# EasyEDA Pro project qn8027_FM调制.eprj

# Schematic Schematic1
Board Name: Board1; Create Date: 2025-07-04; Page Name: P1; Project Name: qn8027_FM调制; Schematic Name: Schematic1; Update Date: 2025-07-05; Company: 嘉立创EDA; Page Size: A4; Version: V1.0
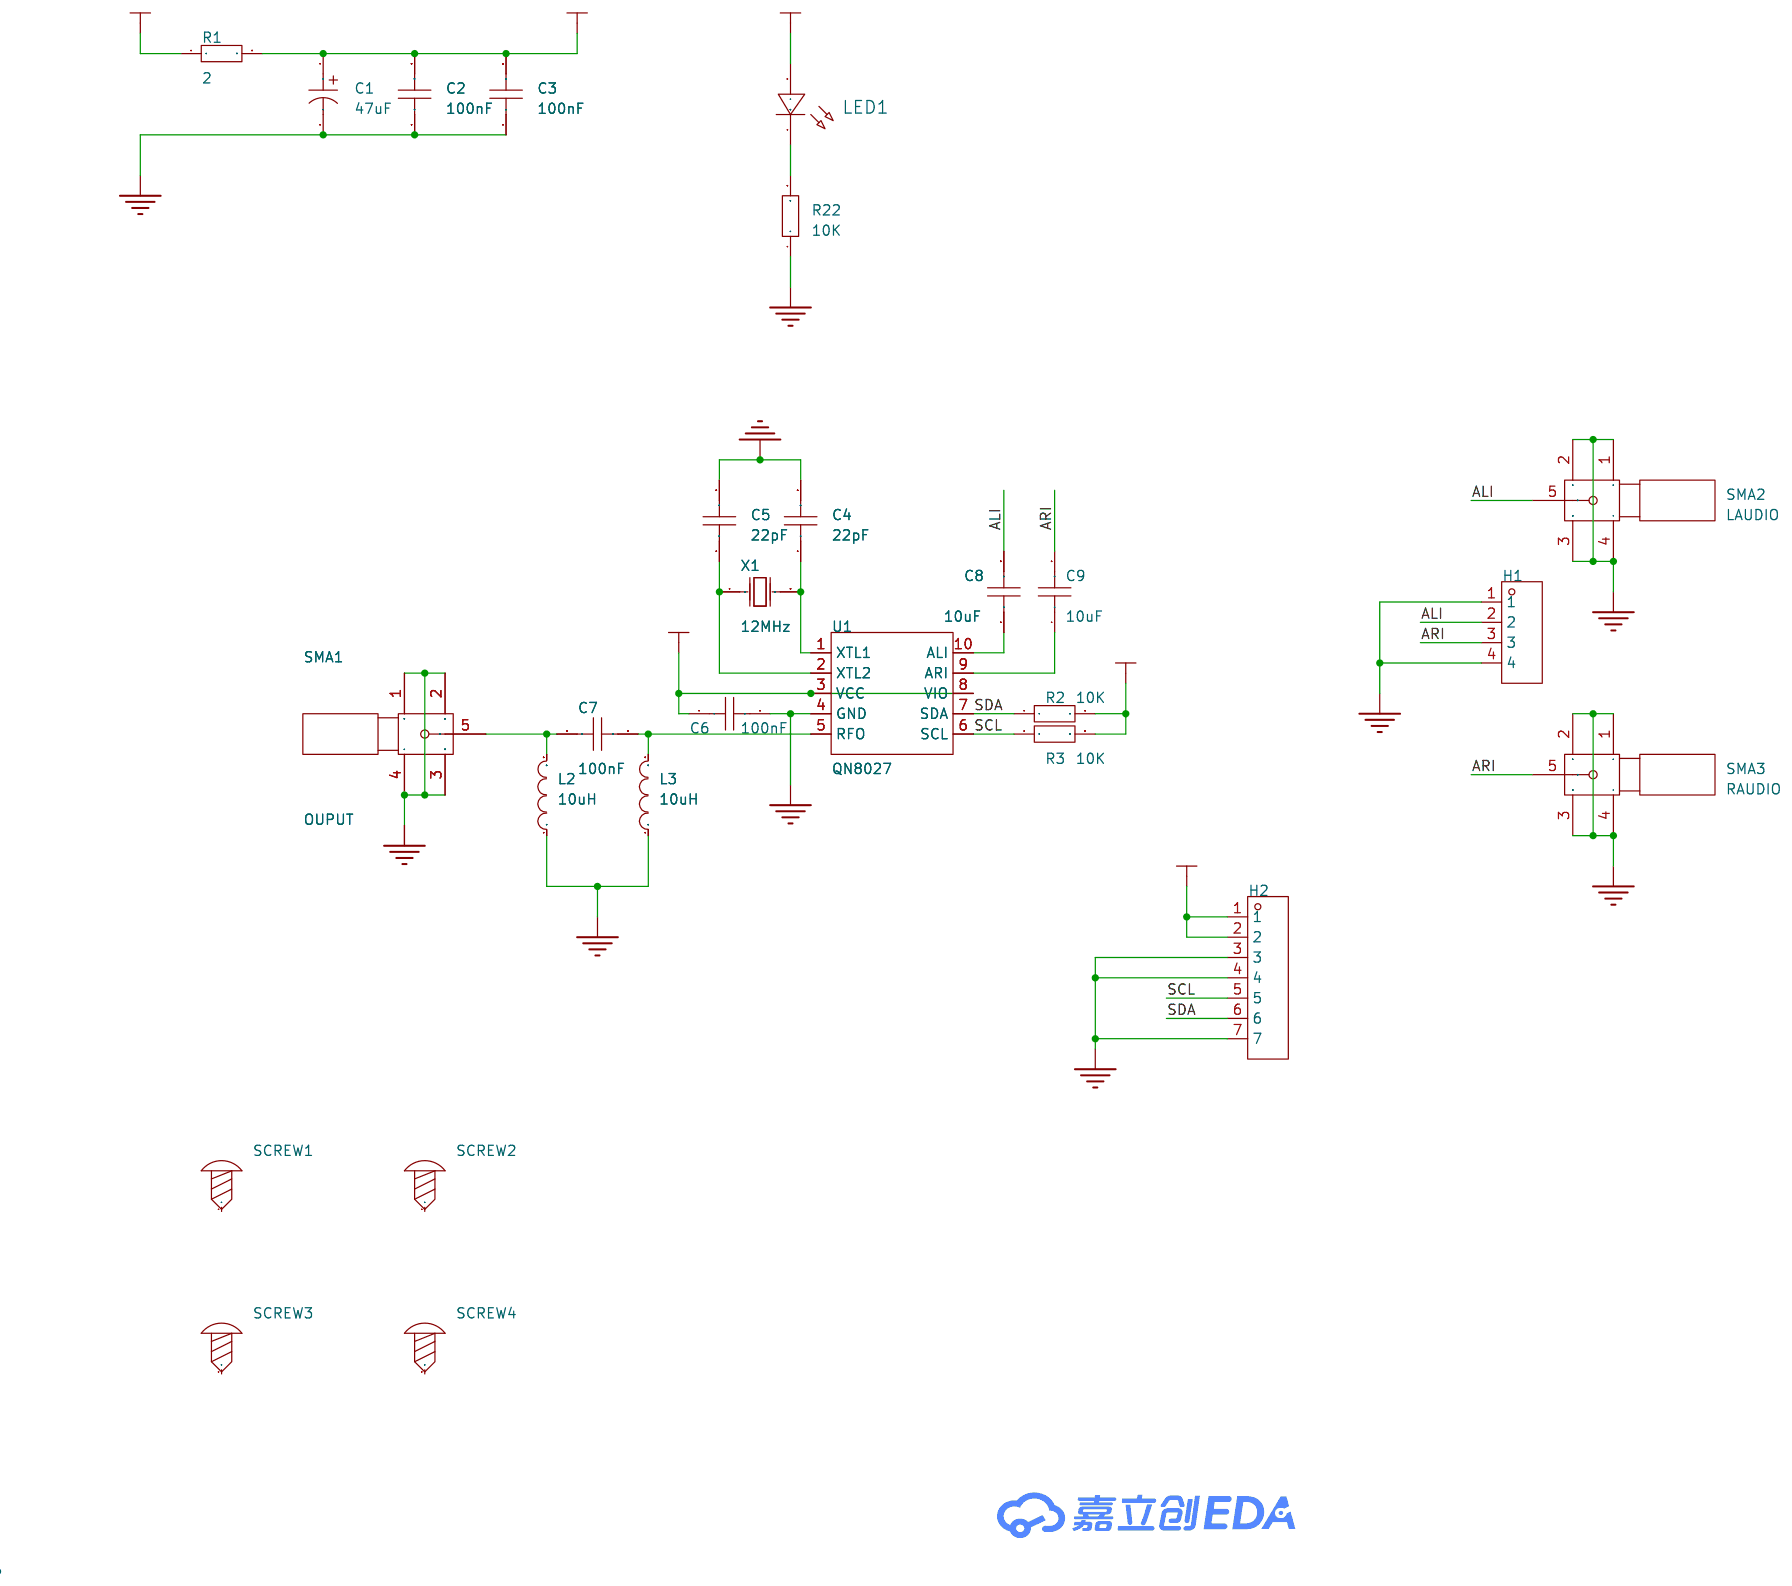
[diagram p0: schematic sheet]

## Parts
C1  47uF  [CAP-TH_BD6.3-P2.50-D0.5-FD]
C2  100nF  [C0603]
C3  100nF  [C0603]
C4  22pF  [C0603]
C5  22pF  [C0603]
C6  100nF  [C0603]
C7  100nF  [C0603]
C8  10uF  [C0603]
C9  10uF  [C0603]
H1  -  [HDR-TH_4P-P2.54-V-M]
H2  -  [HDR-TH_7P-P2.54-V-M]
L2  10uH  [L0603]
L3  10uH  [L0603]
LED1  -  [LED_0603]
R1  2  [R0603]
R2  10K  [R0603]
R3  10K  [R0603]
R22  10K  [R0603]
SCREW1  -  [M2螺丝]
SCREW2  -  [M2螺丝]
SCREW3  -  [M2螺丝]
SCREW4  -  [M2螺丝]
SMA1  OUPUT  [SMA-SMD_BWSMA-KE-P001]
SMA2  LAUDIO  [SMA-SMD_BWSMA-KE-P001]
SMA3  RAUDIO  [SMA-SMD_BWSMA-KE-P001]
U1  QN8027  [MSOP-10_L3.0-W3.0-P0.50-LS4.9-BL]
X1  12MHz  [HC-49US_L11.5-W4.5-P4.88]

## Library data of the parts
C1 = CD26G1HM470E120T: 容值:47uF;精度:±20%;额定电压:50V;纹波电流:234mA@100kHz;等效串联电阻(ESR):710mΩ@100kHz;; LCSC Part Name: 长寿命耐高纹波耐高温，5000H-80000H at 105℃ 47uF ±20% 50V; Supplier Part: C42460502; Manufacturer: 创慧电子; Supplier Footprint: 插件,D6.3xL12mm; Datasheet: https://atta.szlcsc.com/upload/public/pdf/source/20250208/95E25F66E0D5629BBC6A4318C6E986E6.pdf; Supplier: LCSC; Tolerance: ±20%; Voltage Rating: 50V; Ripple Current: 234mA@100kHz; Equivalent Series Resistance(ESR): 710mΩ@100kHz; Pin Spacing: 2.5mm; Diameter: 6.3mm; Height - Seated (Max): 12mm; Lifetime: 8000hrs@105℃; Operating Temperature: -40℃~+105℃
C2-C9 = CAP_0603: Supplier Footprint: 0603
H1 = HDR-M_2.54_1x4P: Supplier Part: C492403; Supplier Footprint: 插件
H2 = HDR-M_2.54_1x7P: Supplier Part: C492406; Supplier Footprint: 插件
L2 L3 = L_0603
LED1 = LED_0603-R: Supplier Footprint: 0603
R1-R3 R22 = Res_0603: Supplier Footprint: 0603
SCREW1-SCREW4 = M2螺丝: Supplier Footprint: 插件
SMA1-SMA3 = SMA: Supplier Part: C9900018296; JLCPCB Part Class: 扩展库; Supplier: LCSC
U1 = QN8027: Supplier Part: C9900018651; Supplier Footprint: MSOP-10; JLCPCB Part Class: 扩展库; Supplier: LCSC
X1 = X49SD12MSD2SC: 晶振类型:直插晶振;频率:12MHz;常温频差:±20ppm;负载电容:20pF;频率稳定度:±30ppm;; LCSC Part Name: HC-49US 12MHZ 2P 49S 20PF ±20PPM -20~70℃（±30PPM）; Supplier Part: C16369; Manufacturer: YXC(扬兴晶振); Supplier Footprint: HC-49S; JLCPCB Part Class: 扩展库; Datasheet: https://atta.szlcsc.com/upload/public/pdf/source/20240329/977D7F2434F98B2BE33270BB9FF3D86D.pdf; Supplier: LCSC; Type: 直插晶振; Normal temperature Frequency Tolerance: ±20ppm; Load Capacitance: 20pF; Frequency Stability: ±30ppm; Operating Temperature: -20℃~+70℃

## Nets
+3.3V: C1.1 C2.2 C3.2 C6.1 LED1.2(A) R1.2 R2.2 R3.2 U1.3(VCC) U1.8(VIO)
GND: C1.2 C2.1 C3.1 C4.2 C5.2 C6.2 H1.1 H1.4 H2.3 H2.4 H2.7 L2.1 L3.1 R22.1 SMA1.1 SMA1.2 SMA1.3 SMA1.4 SMA2.1 SMA2.2 SMA2.3 SMA2.4 SMA3.1 SMA3.2 SMA3.3 SMA3.4 U1.4(GND)
VBAT: H2.1 H2.2 R1.1
ALI: C8.2 H1.2 SMA2.5
ARI: C9.2 H1.3 SMA3.5
SCL: H2.5 R3.1 U1.6(SCL)
SDA: H2.6 R2.1 U1.7(SDA)
$1N709: C4.1 U1.1(XTL1) X1.2(OSC2)
$1N714: C5.1 U1.2(XTL2) X1.1(OSC1)
$1N919: C7.1 L2.2 SMA1.5
$1N921: C7.2 L3.2 U1.5(RFO)
$1N1263: C8.1 U1.10(ALI)
$1N1268: C9.1 U1.9(ARI)
$1N1608: LED1.1(C) R22.2

Not connected (* = marked no-connect by the designer): SCREW1 1; SCREW2 1; SCREW3 1; SCREW4 1

# Board PCB1
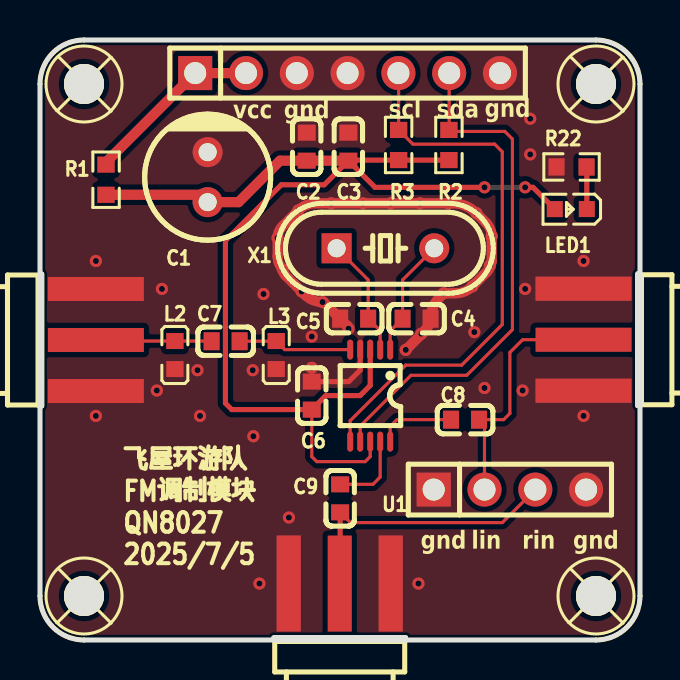
[diagram p1: board, top side]
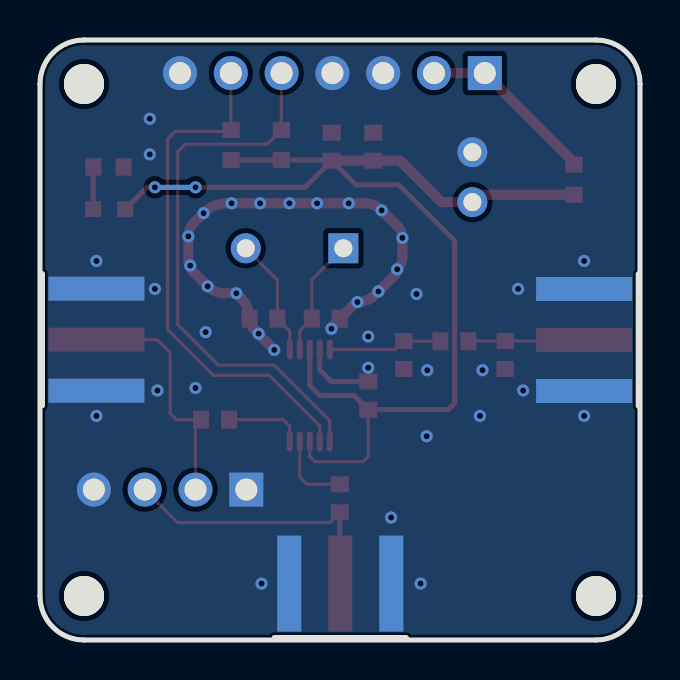
[diagram p2: board, bottom side, seen from below]

Outline 30 x 30 mm; copper layers: Top Layer, Bottom Layer. Coordinates in mm from the lower left corner of the outline.
Outline path: 0,27.8 0,2.2 arc(0.64,0.64) 2.2,0 27.8,0 arc(29.36,0.64) 30,2.2 30,27.8 arc(29.36,29.36) 27.8,30 2.2,30 arc(0.64,29.36) 0,27.8
Stack: Top Layer 0.035mm / Dielectric1 1.51mm FR4 er 4.5 / Bottom Layer 0.035mm

## Design rules (mm)
template: 自定义配置
spacing copperThickness1oz (default): track to track 0.102, other pairs 0.152 to 0.3
spacing copperThickness2oz: track to track 0.203, other pairs 0.152 to 0.3
track width copperThickness1oz (default): min 0.127, default 0.254, max 2.54
track width copperThickness2oz: min 0.203, default 0.254, max 2.54
differential pair differentialPair (default): width min 0.127, default 0.254, max 2.54; gap min 0.152, default 0.152
via viaSize (default): diameter min 0.5, default 0.61, max 10; hole min 0.3, default 0.305, max 6.3
pour e349 uses main
pour e368 uses main

## Placement (name value [footprint] x y rotation side)
C1  47uF  [CAP-TH_BD6.3-P2.50-D0.5-FD]  8.38 23.14 90 top
C2  100nF  [C0603]  13.34 24.67 270 top
C3  100nF  [C0603]  15.42 24.67 270 top
C4  22pF  [C0603]  18.83 16.07 0 top
C5  22pF  [C0603]  15.71 16.07 180 top
C6  100nF  [C0603]  13.59 12.22 90 top
C7  100nF  [C0603]  9.28 14.94 0 top
C8  10uF  [C0603]  21.25 11.02 0 top
C9  10uF  [C0603]  15.01 7.08 270 top
H1  -  [HDR-TH_4P-P2.54-V-M]  23.5 7.52 0 top
H2  -  [HDR-TH_7P-P2.54-V-M]  15.38 28.35 0 top
L2  10uH  [L0603]  6.74 14.25 90 top
L3  10uH  [L0603]  11.81 14.25 90 top
LED1  -  [LED_0603]  26.49 21.54 180 top
R1  2  [R0603]  3.3 23.02 270 top
R2  10K  [R0603]  20.45 24.75 270 top
R3  10K  [R0603]  17.93 24.75 270 top
R22  10K  [R0603]  26.58 23.65 0 top
SCREW1  -  [M2螺丝]  2.2 27.8 0 top
SCREW2  -  [M2螺丝]  27.8 27.8 0 top
SCREW3  -  [M2螺丝]  2.2 2.2 0 top
SCREW4  -  [M2螺丝]  27.8 2.2 0 top
SMA1  OUPUT  [SMA-SMD_BWSMA-KE-P001]  2.79 15 180 top
SMA2  LAUDIO  [SMA-SMD_BWSMA-KE-P001]  27.18 15.01 0 top
SMA3  RAUDIO  [SMA-SMD_BWSMA-KE-P001]  14.99 2.82 270 top
U1  QN8027  [MSOP-10_L3.0-W3.0-P0.50-LS4.9-BL]  16.51 12.22 180 top
X1  12MHz  [HC-49US_L11.5-W4.5-P4.88]  17.27 19.59 0 top

## Footprints (pads in the part's own frame, mm; a bottom-side part is the same pattern mirrored in y, then rotated)
C0603
  rect 0.8x0.9 smd: 1(-0.7,0) 2(0.7,0)
CAP-TH_BD6.3-P2.50-D0.5-FD
  round 1.5 hole 0.9: 1(-1.25,0) 2(1.25,0)
HC-49US_L11.5-W4.5-P4.88
  rect 1.5x1.5 hole 0.9: 1(-2.44,0)
  round 1.5 hole 0.9: 2(2.44,0)
HDR-TH_4P-P2.54-V-M
  rect 1.7x1.7 hole 1.1: 1(-3.81,0)
  round 1.7 hole 1.1: 2(-1.27,0) 3(1.27,0) 4(3.81,0)
HDR-TH_7P-P2.54-V-M
  rect 1.7x1.7 hole 1.1: 1(-7.62,0)
  round 1.7 hole 1.1: 2(-5.08,0) 3(-2.54,0) 4(0,0) 5(2.54,0) 6(5.08,0) 7(7.62,0)
L0603
  rect 0.8x0.864 smd: 1(-0.7,0) 2(0.7,0)
LED_0603
  rect 0.8x0.8 smd: 1(-0.851,-0.01) 2(0.75,-0.005)
M2螺丝
  round 2 hole 2: 1(0,0)
MSOP-10_L3.0-W3.0-P0.50-LS4.9-BL
  oval 0.3x1 smd: 1(-1,-2.3) 2(-0.5,-2.3) 3(0,-2.3) 4(0.5,-2.3) 5(1,-2.3) 6(1,2.3) 7(0.5,2.3) 8(0,2.3) 9(-0.5,2.3) 10(-1,2.3)
R0603
  rect 0.806x0.864 smd: 1(-0.753,0) 2(0.753,0)
SMA-SMD_BWSMA-KE-P001
  rect 4.8x1.2 smd: 1(0,-2.55) 2(0,2.55) 5(0,0)
  rect 4.8x1.2 smd far side: 3(0,2.55) 4(0,-2.55)

## Nets
As in the schematic.

Pads without a net: SCREW1 1; SCREW2 1; SCREW3 1; SCREW4 1

## Via types
v1: diameter 0.61, hole 0.305, Top Layer to Bottom Layer, 42 vias

## Routing (per net, layer and track width the routed paths; a pad name or vN(x,y) marks a point on that pad's centre or on a via; arc(x,y) is an arc through that point)
+3.3V: length 61.3
  Top Layer w0.158: U1.8 16.51,9.17 16.26,8.92 13.84,8.92 13.59,9.17 C6.1
  Top Layer w0.254: C3.2 15.45,24 20.45,24 ; C3.2 14.21,22.76 12.06,22.76 9.27,19.97 9.27,11.84 9.59,11.52 C6.1 14.29,12.22 16,12.22 16.51,12.73 U1.3 ; C3.2 16.75,22.63 v1(22.22,22.63) ; LED1.2 24.65,22.63 v1(24.26,22.63)
  Top Layer w0.508: C3.2 C2.2 12,23.97 9.93,21.89 C1.1 8.01,22.26 R1.2
  Bottom Layer w0.254: v1(24.26,22.63) v1(22.22,22.63)
GND: length 30.2
  Top Layer w0.254: U1.4 16.01,13.5 15.43,12.92 C6.2
  Top Layer w0.508: v1(18.29,14.51) 19.05,15.26 arc(19.06,15.29) v1(19.07,15.32) 19.32,15.57 arc(19.48,15.8) C4.2 arc(19.64,16.63) 19.96,17.12 v1(20.18,17.34) 20.78,17.34 arc(21.23,17.43) v1(21.62,17.68) 22.38,18.44 arc(22.46,18.57) v1(22.49,18.72) arc(22.56,18.82) 22.58,18.94 v1(22.58,20.18) arc(22.51,20.55) 22.3,20.86 v1(21.82,21.34) arc(21.27,21.71) 20.63,21.84 v1(20.42,21.84) v1(19,21.84) v1(17.53,21.84) v1(16.15,21.84) v1(14.56,21.84) 13.77,21.84 arc(13.31,21.74) v1(12.92,21.48) 12.12,20.68 arc(11.94,20.42) v1(11.88,20.1) 11.88,19.16 arc(11.95,18.82) v1(12.14,18.53) arc(12.17,18.38) 12.26,18.25 v1(13.08,17.43) 13.25,17.26 arc(13.65,16.99) v1(14.13,16.89) arc(14.18,16.88) 14.22,16.86 C5.2 15.37,15.71 arc(15.41,15.64) v1(15.43,15.56)
  vias: v1(2.79,18.95) v1(2.79,11.2) v1(5.84,12.47) v1(6.1,17.55) v1(7.87,13.49) v1(8,11.2) v1(10.64,13.49) v1(10.67,10.19) v1(10.97,2.82) v1(11.18,17.3) v1(12.45,6.12) v1(13.59,15.17) v1(13.59,13.61) v1(18.92,2.82) v1(21.72,15.39) v1(22.22,12.6) v1(24.13,12.47) v1(24.26,17.55) v1(24.51,26.06) v1(24.51,24.28) v1(27.18,18.95) v1(27.18,11.2)
VBAT: length 9
  Top Layer w0.508: R1.1 3.3,23.89 H2.1 H2.2
ALI: length 12.3
  Top Layer w0.158: SMA2.5 24.13,15.01 23.5,14.38 23.5,11.33 23.18,11.02 C8.2 22.22,10.75 H1.2
ARI: length 14.2
  Top Layer w0.158: C9.2 15.52,5.87 23.11,5.87 24.76,7.52
  Top Layer w0.254: SMA3.5 15.01,2.84 C9.2
SCL: length 27.8
  Top Layer w0.158: U1.6 15.51,10.97 18.29,13.74 21.08,13.74 23.11,15.78 23.11,24.41 22.73,24.79 18.64,24.79 R3.1 17.93,28.33 H2.5
SDA: length 26.1
  Top Layer w0.158: U1.7 16.01,10.7 18.55,13.24 21.34,13.24 23.62,15.52 23.62,25.05 23.24,25.43 20.52,25.43 R2.1 20.46,25.52 H2.6
$1N709: length 6
  Top Layer w0.158: U1.1 17.51,15.45 18.13,16.07 18.13,18 X1.2
$1N714: length 6
  Top Layer w0.158: X1.1 16.41,18.01 C5.1 17.01,15.47 U1.2
$1N919: length 5.8
  Top Layer w0.158: SMA1.5 2.85,14.95 L2.2 8.57,14.95 C7.1
$1N921: length 5.7
  Top Layer w0.158: C7.2 11.8,14.94 L3.2 12.24,14.52 U1.5
$1N1263: length 3.9
  Top Layer w0.158: C8.1 17.85,11.02 17.51,10.68 U1.10
$1N1268: length 3.9
  Top Layer w0.158: U1.9 17.01,8.15 16.65,7.78 C9.1
$1N1608: length 2.1
  Top Layer w0.254: R22.2 27.34,23.64 LED1.1

## Copper pours and planes (outline as drawn; the poured copper is in the pictures)
GND on Top Layer: -1.27,32.03 31.37,32.03 31.37,-1.62 -1.27,-1.62
GND on Bottom Layer: -1,32.03 31.12,32.03 31.12,-1.5 -1,-1.5

## Text on the board
Top Silkscreen Layer: vcc | gnd | scl | sda | lin | rin | 飞屋环游队 / FM调制模块 / QN8027 / 2025/7/5
